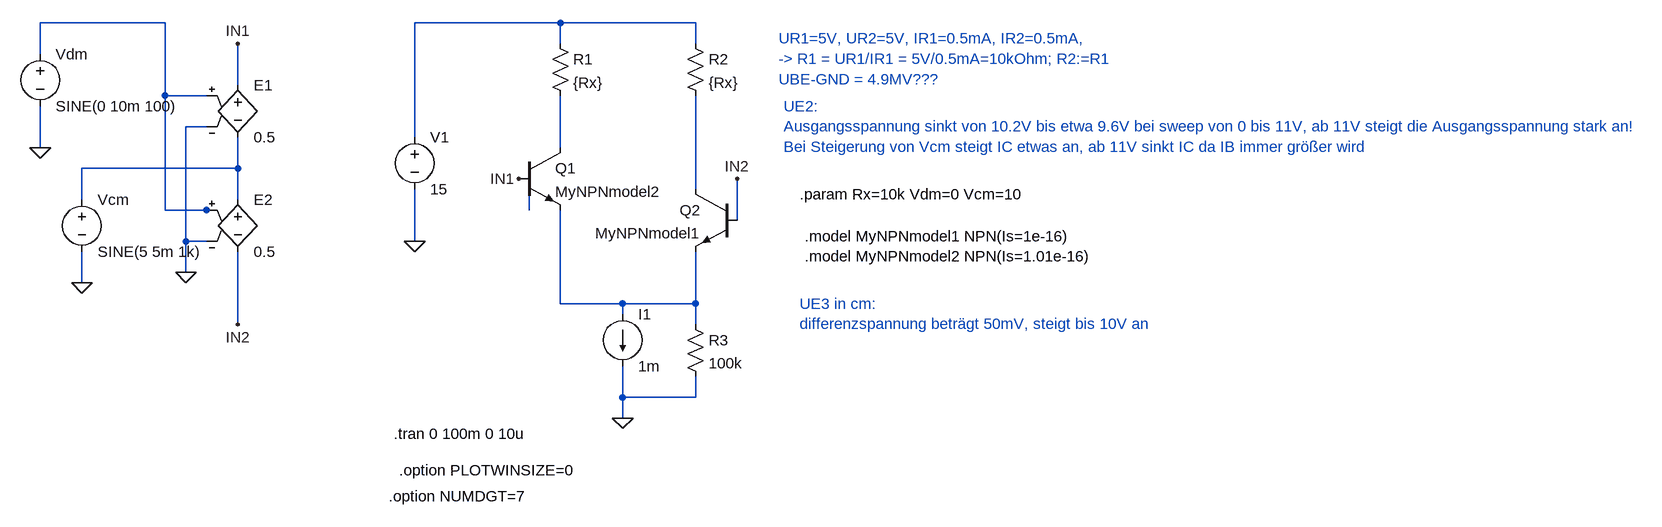
[diagram p0: schematic LaboruebungDiffVerstaerkerRealSweep.asc]
LaboruebungDiffVerstaerkerRealSweep.asc, the LTspice schematic file:
Version 4
SHEET 1 1908 680
WIRE -464 -256 -656 -256
WIRE 144 -256 -80 -256
WIRE 352 -256 144 -256
WIRE 144 -224 144 -256
WIRE 352 -224 352 -256
WIRE -656 -208 -656 -256
WIRE -352 -160 -352 -224
WIRE -464 -144 -464 -256
WIRE -400 -144 -464 -144
WIRE -400 -96 -432 -96
WIRE -80 -80 -80 -256
WIRE -656 -64 -656 -128
WIRE 144 -64 144 -144
WIRE -352 -32 -352 -80
WIRE -352 -32 -592 -32
WIRE 352 0 352 -144
WIRE -592 16 -592 -32
WIRE -352 16 -352 -32
WIRE -464 32 -464 -144
WIRE -400 32 -464 32
WIRE -384 32 -400 32
WIRE 96 32 96 -16
WIRE 416 48 416 -16
WIRE -432 80 -432 -96
WIRE -400 80 -432 80
WIRE -80 80 -80 0
WIRE -432 128 -432 80
WIRE -592 144 -592 96
WIRE 144 176 144 32
WIRE 240 176 144 176
WIRE 352 176 352 96
WIRE 352 176 240 176
WIRE 240 192 240 176
WIRE -352 208 -352 96
WIRE 352 208 352 176
WIRE 240 320 240 272
WIRE 352 320 352 288
WIRE 352 320 240 320
WIRE 240 352 240 320
FLAG 240 352 0
FLAG -80 80 0
FLAG 80 -16 IN1
FLAG 416 -16 IN2
FLAG -352 208 IN2
FLAG -432 128 0
FLAG -592 144 0
FLAG -656 -64 0
FLAG -352 -224 IN1
SYMBOL current 240 192 R0
WINDOW 123 0 0 Left 0
WINDOW 39 0 0 Left 0
SYMATTR InstName I1
SYMATTR Value 1m
SYMBOL voltage -80 -96 R0
WINDOW 123 0 0 Left 0
WINDOW 39 0 0 Left 0
SYMATTR InstName V1
SYMATTR Value 15
SYMBOL npn 80 -64 R0
SYMATTR InstName Q1
SYMATTR Value MyNPNmodel2
SYMBOL npn 416 0 M0
SYMATTR InstName Q2
SYMATTR Value MyNPNmodel1
SYMBOL res 128 -240 R0
SYMATTR InstName R1
SYMATTR Value {Rx}
SYMBOL res 336 -240 R0
SYMATTR InstName R2
SYMATTR Value {Rx}
SYMBOL e -352 -176 R0
SYMATTR InstName E1
SYMATTR Value 0.5
SYMBOL e -352 0 R0
SYMATTR InstName E2
SYMATTR Value 0.5
SYMBOL voltage -656 -224 R0
WINDOW 123 0 0 Left 0
WINDOW 39 0 0 Left 0
SYMATTR InstName Vdm
SYMATTR Value SINE(0 10m 100)
SYMBOL voltage -592 0 R0
WINDOW 123 0 0 Left 0
WINDOW 39 0 0 Left 0
SYMATTR InstName Vcm
SYMATTR Value SINE(5 5m 1k)
SYMBOL res 336 192 R0
SYMATTR InstName R3
SYMATTR Value 100k
TEXT -112 376 Left 2 !.tran 0 100m 0 10u
TEXT 480 -232 Left 2 ;UR1=5V, UR2=5V, IR1=0.5mA, IR2=0.5mA, \n-> R1 = UR1/IR1 = 5V/0.5mA=10kOhm; R2:=R1\nUBE-GND = 4.9MV???
TEXT 512 8 Left 2 !.param Rx=10k Vdm=0 Vcm=10
TEXT 488 -128 Left 2 ;UE2:\nAusgangsspannung sinkt von 10.2V bis etwa 9.6V bei sweep von 0 bis 11V, ab 11V steigt die Ausgangsspannung stark an!\nBei Steigerung von Vcm steigt IC etwas an, ab 11V sinkt IC da IB immer größer wird
TEXT 520 72 Left 2 !.model MyNPNmodel1 NPN(Is=1e-16)\n.model MyNPNmodel2 NPN(Is=1.01e-16)
TEXT 512 176 Left 2 ;UE3 in cm:\ndifferenzspannung beträgt 50mV, steigt bis 10V an
TEXT -120 472 Left 2 !.option NUMDGT=7
TEXT -104 432 Left 2 !.option PLOTWINSIZE=0

The netlist it stands for:
* LaboruebungDiffVerstaerkerRealSweep.asc
I1 N007 0 1m
V1 N002 0 15
Q1 N003 IN1 N007 0 MyNPNmodel2
Q2 N005 IN2 N007 0 MyNPNmodel1
R1 N002 N003 {Rx}
R2 N002 N005 {Rx}
E1 IN1 N004 N001 0 0.5
E2 N004 IN2 N001 0 0.5
Vdm N001 0 SINE(0 10m 100)
Vcm N004 0 SINE(5 5m 1k)
R3 N007 0 100k
.model NPN NPN
.model PNP PNP
.lib standard.bjt
.tran 0 100m 0 10u
* UR1=5V, UR2=5V, IR1=0.5mA, IR2=0.5mA,
* -> R1 = UR1/IR1 = 5V/0.5mA=10kOhm; R2:=R1
* UBE-GND = 4.9MV???
.param Rx=10k Vdm=0 Vcm=10
* UE2:
* Ausgangsspannung sinkt von 10.2V bis etwa 9.6V bei sweep von 0 bis 11V, ab 11V steigt die Ausgangsspannung stark an!
* Bei Steigerung von Vcm steigt IC etwas an, ab 11V sinkt IC da IB immer größer wird
.model MyNPNmodel1 NPN(Is=1e-16)
.model MyNPNmodel2 NPN(Is=1.01e-16)
* UE3 in cm:
* differenzspannung beträgt 50mV, steigt bis 10V an
.option NUMDGT=7
.option PLOTWINSIZE=0
.backanno
.end